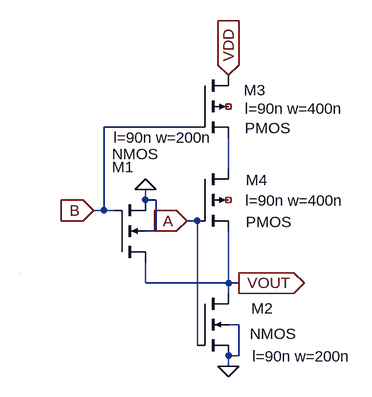
[diagram p0: schematic NOR.asc]
NOR.asc, the LTspice schematic file:
Version 4
SHEET 1 880 680
WIRE 272 -224 128 -224
WIRE 320 -160 320 -208
WIRE 192 -112 192 -128
WIRE 208 -112 192 -112
WIRE 128 -96 128 -224
WIRE 128 -96 112 -96
WIRE 144 -96 128 -96
WIRE 272 -80 256 -80
WIRE 208 -64 208 -112
WIRE 208 -64 192 -64
WIRE 192 16 192 -16
WIRE 320 16 320 -64
WIRE 320 16 192 16
WIRE 336 16 320 16
WIRE 320 32 320 16
WIRE 336 80 320 80
WIRE 272 112 272 -80
WIRE 336 128 336 80
WIRE 336 128 320 128
WIRE 320 144 320 128
WIRE 0 0 0 0
FLAG 192 -128 0
FLAG 320 144 0
FLAG 256 -80 A
IOPIN 256 -80 In
FLAG 112 -96 B
IOPIN 112 -96 In
FLAG 336 16 VOUT
IOPIN 336 16 Out
FLAG 320 -304 VDD
IOPIN 320 -304 In
SYMBOL nmos4 144 -16 M180
WINDOW 123 -1 192 Left 2
WINDOW 0 -3 147 Left 2
WINDOW 3 -3 167 Left 2
SYMATTR Value2 l=90n w=200n
SYMATTR InstName M1
SYMBOL nmos4 272 32 R0
WINDOW 123 85 97 Left 2
WINDOW 0 83 23 Left 2
WINDOW 3 81 62 Left 2
SYMATTR Value2 l=90n w=200n
SYMATTR InstName M2
SYMBOL pmos4 272 -304 R0
WINDOW 123 73 51 Left 2
WINDOW 0 72 23 Left 2
WINDOW 3 73 81 Left 2
SYMATTR Value2 l=90n w=400n
SYMATTR InstName M3
SYMBOL pmos4 272 -160 R0
WINDOW 123 74 49 Left 2
WINDOW 0 75 17 Left 2
WINDOW 3 75 82 Left 2
SYMATTR Value2 l=90n w=400n
SYMATTR InstName M4

The netlist it stands for:
* NOR.asc
M1 VOUT B 0 0 NMOS l=90n w=200n
M2 VOUT A 0 0 NMOS l=90n w=200n
M3 VDD B N001 NC_01 PMOS l=90n w=400n
M4 N001 A VOUT NC_02 PMOS l=90n w=400n
.model NMOS NMOS
.model PMOS PMOS
.lib standard.mos
.backanno
.end